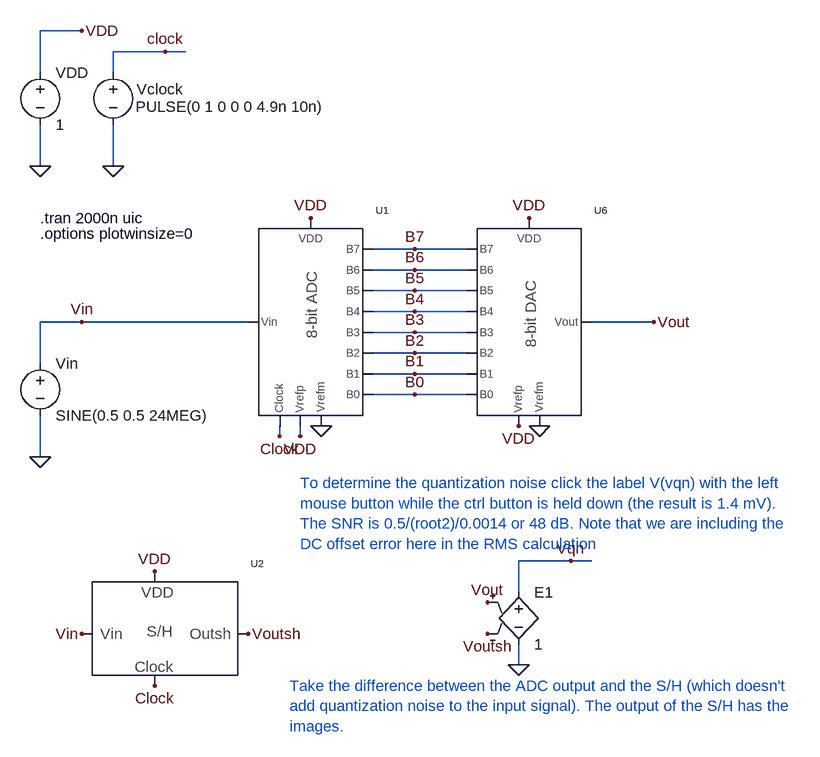
[diagram p0: schematic _Fig5_15_noise_MSD.asc]
_Fig5_15_noise_MSD.asc, the LTspice schematic file:
Version 4
SHEET 1 2740 696
WIRE 512 -832 448 -832
WIRE 640 -800 560 -800
WIRE 672 -800 640 -800
WIRE 448 -768 448 -832
WIRE 560 -768 560 -800
WIRE 448 -624 448 -688
WIRE 560 -624 560 -688
WIRE 1024 -496 960 -496
WIRE 1104 -496 1024 -496
WIRE 1024 -464 960 -464
WIRE 1104 -464 1024 -464
WIRE 1024 -432 960 -432
WIRE 1104 -432 1024 -432
WIRE 1024 -400 960 -400
WIRE 1104 -400 1024 -400
WIRE 512 -384 448 -384
WIRE 768 -384 512 -384
WIRE 1392 -384 1296 -384
WIRE 1024 -368 960 -368
WIRE 1104 -368 1024 -368
WIRE 1024 -336 960 -336
WIRE 1104 -336 1024 -336
WIRE 448 -320 448 -384
WIRE 1024 -304 960 -304
WIRE 1104 -304 1024 -304
WIRE 1024 -272 960 -272
WIRE 1104 -272 1024 -272
WIRE 816 -208 816 -224
WIRE 848 -208 848 -224
WIRE 448 -176 448 -240
WIRE 1264 -16 1184 -16
WIRE 1296 -16 1264 -16
WIRE 1184 32 1184 -16
WIRE 1184 144 1184 112
FLAG 448 -176 0
FLAG 512 -384 Vin
FLAG 560 -624 0
FLAG 640 -800 clock
FLAG 448 -624 0
FLAG 512 -832 VDD
FLAG 1392 -384 Vout
FLAG 1184 -224 VDD
FLAG 1216 -224 0
FLAG 1024 -496 B7
FLAG 1024 -464 B6
FLAG 1024 -432 B5
FLAG 1024 -400 B4
FLAG 1024 -368 B3
FLAG 1024 -336 B2
FLAG 1024 -304 B1
FLAG 1024 -272 B0
FLAG 1200 -544 VDD
FLAG 864 -544 VDD
FLAG 880 -224 0
FLAG 816 -208 Clock
FLAG 848 -208 VDD
FLAG 624 0 VDD
FLAG 512 96 Vin
FLAG 624 176 Clock
FLAG 768 96 Voutsh
FLAG 1184 144 0
FLAG 1136 48 Vout
FLAG 1136 96 Voutsh
FLAG 1264 -16 Vqn
SYMBOL voltage 448 -336 R0
WINDOW 123 0 0 Left 0
WINDOW 39 0 0 Left 0
SYMATTR InstName Vin
SYMATTR Value SINE(0.5 0.5 24MEG)
SYMBOL voltage 560 -784 R0
WINDOW 0 36 42 Left 0
WINDOW 3 35 69 Left 0
WINDOW 123 0 0 Left 0
WINDOW 39 0 0 Left 0
SYMATTR InstName Vclock
SYMATTR Value PULSE(0 1 0 0 0 4.9n 10n)
SYMBOL voltage 448 -784 R0
WINDOW 123 0 0 Left 0
WINDOW 39 0 0 Left 0
SYMATTR InstName VDD
SYMATTR Value 1
SYMBOL Ideal_8_bit_DAC 1120 -240 R0
SYMATTR InstName U6
SYMBOL Ideal_8_bit_ADC 784 -240 R0
SYMATTR InstName U1
SYMBOL Sample_and_hold 528 160 R0
SYMATTR InstName U2
SYMBOL e 1184 16 R0
SYMATTR InstName E1
SYMATTR Value 1
TEXT 448 -544 Left 0 !.tran 2000n uic
TEXT 848 -136 Left 0 ;To determine the quantization noise click the label V(vqn) with the left\nmouse button while the ctrl button is held down (the result is 1.4 mV).\nThe SNR is 0.5/(root2)/0.0014 or 48 dB. Note that we are including the\nDC offset error here in the RMS calculation
TEXT 832 176 Left 0 ;Take the difference between the ADC output and the S/H (which doesn't\nadd quantization noise to the input signal). The output of the S/H has the \nimages.
TEXT 448 -520 Left 0 !.options plotwinsize=0

The netlist it stands for:
* _Fig5_15_noise_MSD.asc
Vin Vin 0 SINE(0.5 0.5 24MEG)
Vclock clock 0 PULSE(0 1 0 0 0 4.9n 10n)
VDD VDD 0 1
XU6 B7 B6 B5 B4 B3 B2 B1 B0 Vout VDD 0 VDD Ideal_8_bit_DAC  ; pins B7 B6 B5 B4 B3 B2 B1 B0 Vout Vrefp Vrefm VDD
XU1 B7 B6 B5 B4 B3 B2 B1 B0 Vin VDD 0 clock VDD Ideal_8_bit_ADC  ; pins B7 B6 B5 B4 B3 B2 B1 B0 Vin Vrefp Vrefm Clock VDD
XU2 Vin Voutsh clock VDD Sample_and_hold  ; pins Vin Outsh Clock VDD
E1 Vqn 0 Vout Voutsh 1
.tran 2000n uic
* To determine the quantization noise click the label V(vqn) with the left
* mouse button while the ctrl button is held down (the result is 1.4 mV).
* The SNR is 0.5/(root2)/0.0014 or 48 dB. Note that we are including the
* DC offset error here in the RMS calculation
* Take the difference between the ADC output and the S/H (which doesn't
* add quantization noise to the input signal). The output of the S/H has the
* images.
.options plotwinsize=0
.backanno
.end